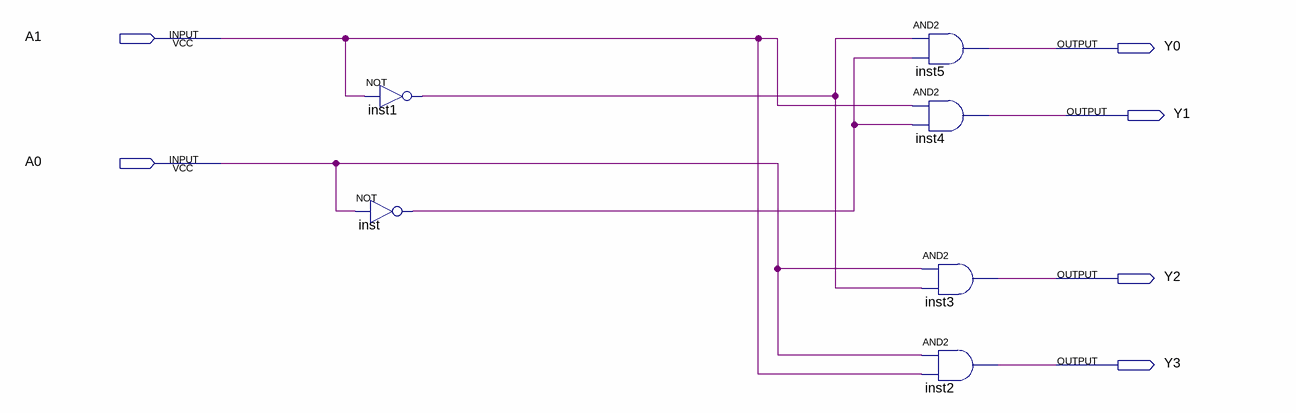
[diagram p0: schematic sheet]
// Quartus schematic Decoder2_4.bdf as structural Verilog: 6 symbols, 6 pins
module Decoder2_4 (
  input  A1,
  input  A0,
  output Y0,
  output Y1,
  output Y2,
  output Y3
);

  wire inst1_out, inst_out;

  not inst1 (inst1_out, A1);
  not inst (inst_out, A0);
  and inst5 (Y0, inst1_out, inst_out);
  and inst4 (Y1, A1, inst_out);
  and inst3 (Y2, A0, inst1_out);
  and inst2 (Y3, A0, A1);
endmodule
